# Altium schematic sheet smart-switches.SchDoc
size A3; DocumentNumber: 19; SheetNumber: 19; SheetTotal: 45; SheetDescription: Smart High-Side Switches
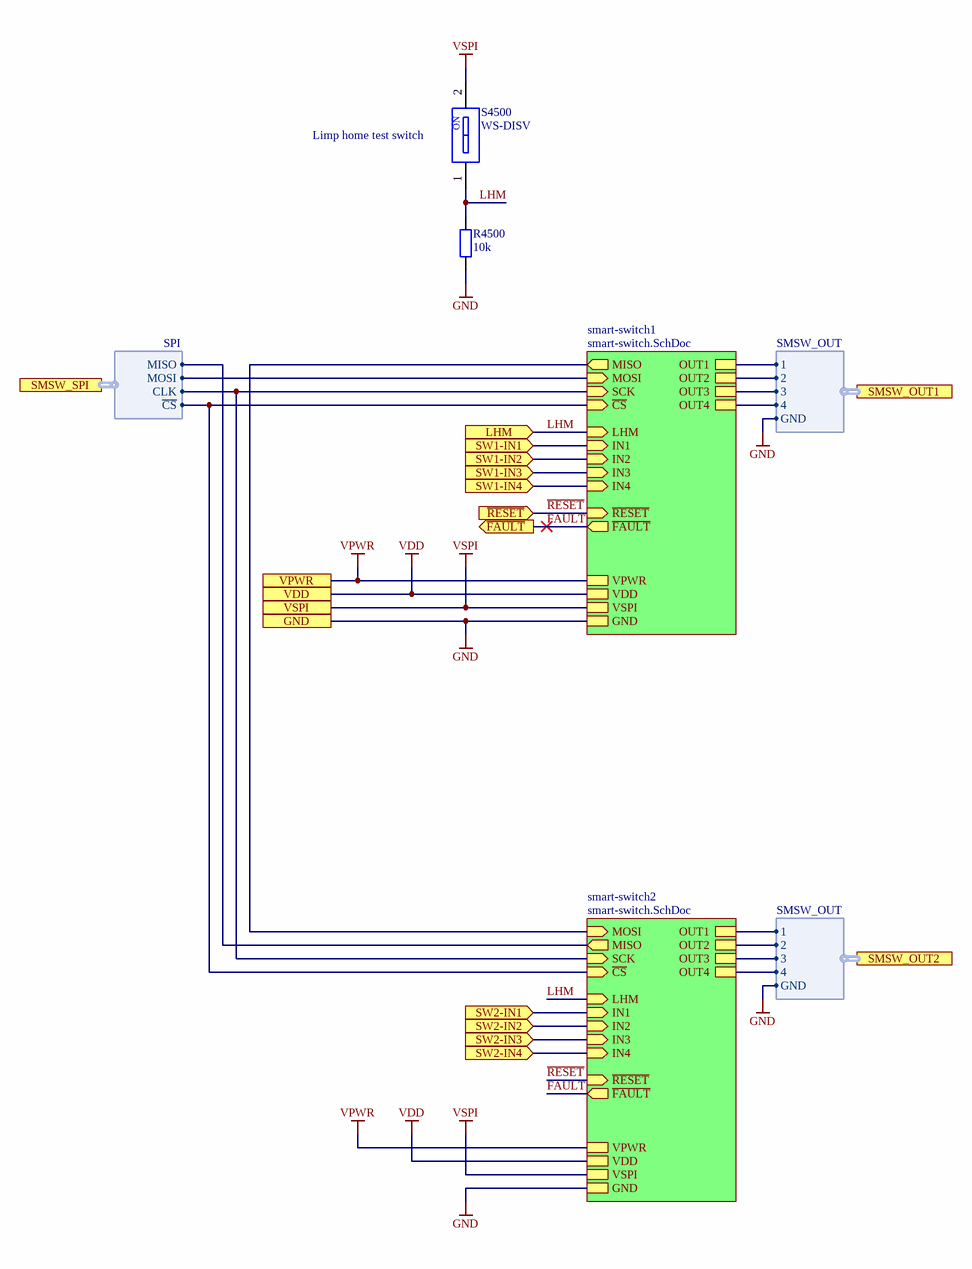
[diagram p0: smart-switches.SchDoc]

## Parts
R4500  10k  [RESC1005X04N]
S4500  WS-DISV  [WE_416131160801]

## Sub-sheets
smart-switch1 = smart-switch.SchDoc: SCK (in), ~{CS} (in), OUT2, MISO (out), OUT1, OUT3, OUT4, LHM (in), MOSI (in), ~{RESET} (in), GND, VSPI, VPWR, ~{FAULT} (out), VDD, IN2 (in), IN3 (in), IN1 (in), IN4 (in)
smart-switch2 = smart-switch.SchDoc: SCK (in), ~{CS} (in), OUT2, MISO (out), OUT1, OUT3, OUT4, LHM (in), MOSI (in), ~{RESET} (in), GND, VSPI, VPWR, ~{FAULT} (out), VDD, IN4 (in), IN3 (in), IN2 (in), IN1 (in)

## Ports
GND, LHM (in), SMSW_OUT1 (harness SMSW_OUT), SMSW_OUT2 (harness SMSW_OUT), SMSW_SPI (harness SPI), SW1-IN1 (in), SW1-IN2 (in), SW1-IN3 (in), SW1-IN4 (in), SW2-IN1 (in), SW2-IN2 (in), SW2-IN3 (in), SW2-IN4 (in), VDD, VPWR, VSPI, ~{FAULT} (out), ~{RESET} (in)

## Harnesses
SMSW_OUT: 1, 2, 3, 4, GND
SPI: CLK, MOSI, MISO, ~{CS}

## Nets
GND: R4500.1 ; port GND, sheet smart-switch1/GND, sheet smart-switch2/GND, port SMSW_OUT1.GND, port SMSW_OUT2.GND
VDD: port VDD, sheet smart-switch1/VDD, sheet smart-switch2/VDD
VPWR: port VPWR, sheet smart-switch1/VPWR, sheet smart-switch2/VPWR
VSPI: S4500.2 ; port VSPI, sheet smart-switch1/VSPI, sheet smart-switch2/VSPI
~{FAULT}: port ~{FAULT}, sheet smart-switch1/~{FAULT}, sheet smart-switch2/~{FAULT}
~{RESET}: port ~{RESET}, sheet smart-switch1/~{RESET}, sheet smart-switch2/~{RESET}
LHM: R4500.2 S4500.1 ; port LHM, sheet smart-switch1/LHM, sheet smart-switch2/LHM
SW1-IN1: port SW1-IN1, sheet smart-switch1/IN1
SW1-IN2: port SW1-IN2, sheet smart-switch1/IN2
SW1-IN3: port SW1-IN3, sheet smart-switch1/IN3
SW1-IN4: port SW1-IN4, sheet smart-switch1/IN4
SW2-IN1: port SW2-IN1, sheet smart-switch2/IN1
SW2-IN2: port SW2-IN2, sheet smart-switch2/IN2
SW2-IN3: port SW2-IN3, sheet smart-switch2/IN3
SW2-IN4: port SW2-IN4, sheet smart-switch2/IN4
(unnamed): sheet smart-switch1/SCK, sheet smart-switch2/SCK, port SMSW_SPI.CLK
(unnamed): sheet smart-switch1/~{CS}, sheet smart-switch2/~{CS}, port SMSW_SPI.~{CS}
(unnamed): sheet smart-switch1/OUT2, port SMSW_OUT1.2
(unnamed): sheet smart-switch1/MISO, sheet smart-switch2/MOSI
(unnamed): sheet smart-switch1/OUT1, port SMSW_OUT1.1
(unnamed): sheet smart-switch1/OUT3, port SMSW_OUT1.3
(unnamed): sheet smart-switch1/OUT4, port SMSW_OUT1.4
(unnamed): sheet smart-switch1/MOSI, port SMSW_SPI.MOSI
(unnamed): sheet smart-switch2/OUT2, port SMSW_OUT2.2
(unnamed): sheet smart-switch2/MISO, port SMSW_SPI.MISO
(unnamed): sheet smart-switch2/OUT1, port SMSW_OUT2.1
(unnamed): sheet smart-switch2/OUT3, port SMSW_OUT2.3
(unnamed): sheet smart-switch2/OUT4, port SMSW_OUT2.4

## Notes on the sheet
- (near S4500) Limp home test switch
- Fraunhofer IISB
- Schottkystr. 10
- developed by:
- 91058 Erlangen
- Germany
- Author
- Project
- License
- Description
- File
- Version
- Release Date
- Sheet
- foxbms.org <https://foxbms.org>
- www.iisb.fraunhofer.de <https://www.iisb.fraunhofer.de/>
- foxBMS Team
- /
- (in symbol WE_416131160801) ON

## Library data of the parts
R4500 = gen_R_10k_0402: SMD Resistor 10k 0402; Tolerance: 1%; Power: 0.063W; Case EIA: 0402; Case Metric: 1005; Maximum Working Voltage: 50V; PnP Package: 0402R; Automotive Qualified: True; PnP equipped: x; AEC-Q Norm: AEC-Q200; Part Number: gen_R_10k_0402; Operating Temperature: -55°C - +155°C; Resistance: 10k; Series: E24, E96; PnP Value: 10k; Supplier 1: Farnell; Supplier Part Number 1: 2059239; ECCN: EAR99
S4500 = WE_416131160801: WS-DISV Small Compact SMT DipSwitch; Manufacturer: Würth Elektronik; Automotive Qualified: False; Part Number: WE_416131160801; Part Name: WS-DISV; Operating Temperature: -40°C - +85°C; ComponentLink1Description: Datasheet; ComponentLink1URL: https://www.we-online.de/katalog/datasheet/418121270801.pdf; Supplier 1: Digikey; Supplier Part Number 1: 732-3851-1-ND; Supplier 2: Mouser; Supplier Part Number 2: 710-416131160801